# Altium schematic sheet STM32F446_Supply.SchDoc
size A4; DocumentNumber: 10; SheetNumber: 10; SheetTotal: 11
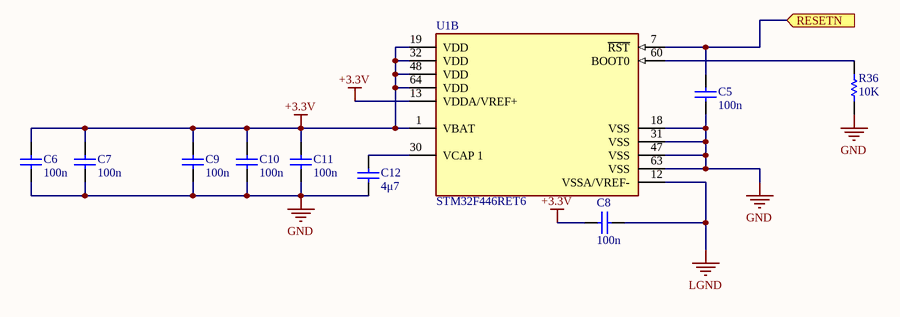
[diagram p0: STM32F446_Supply.SchDoc]

## Parts
C5  100n  [CAPC0603(1608)55_N]
C6  100n  [CAPC0603(1608)55_N]
C7  100n  [CAPC0603(1608)55_N]
C8  100n  [CAPC0603(1608)55_N]
C9  100n  [CAPC0603(1608)55_N]
C10  100n  [CAPC0603(1608)55_N]
C11  100n  [CAPC0603(1608)55_N]
C12  4μ7  [CAPC0603(1608)55_N]
R36  10K  [RESC0603(1608)_N]
U1  STM32F446RET6  [FP-LQFP64-5W-MFG]  (part B of 2)

## Ports
RESETN (in)

## Nets
+3.3V: C6.2 C7.2 C8.2 C9.2 C10.2 C11.2 U1.1(VBAT) U1.13(VDDA/VREF+) U1.19(VDD) U1.32(VDD) U1.48(VDD) U1.64(VDD)
GND: C5.1 C6.1 C7.1 C9.1 C10.1 C11.1 C12.1 R36.1 U1.18(VSS) U1.31(VSS) U1.47(VSS) U1.63(VSS)
LGND: C8.1 U1.12(VSSA/VREF-)
RESETN: C5.2 U1.7(~{RST}) ; port RESETN
NetC12_2: C12.2 U1.30(VCAP_1)
NetR36_2: R36.2 U1.60(BOOT0)

## Library data of the parts
C5-C11 = Cap 100n: Keramikvielschichtkondensator, SMD, Baureihe MC, ± 10%; Manufacturer: TDK; Voltage Rating: 50V; OC_MOUSER: CGA3E2X7R1H104K080AA; Value: 100n; PackageReference: 0603; Tolerance: ± 10%
C12 = Cap 4μ7: Keramikvielschichtkondensator, SMD, Baureihe MC, ± 10%; Manufacturer: TDK; Voltage Rating: 6.3V; OC_MOUSER: CGA3E1X5R0J475K080AC; Value: 4μ7; PackageReference: 0603; Tolerance: ± 10%
R36 = Res 10K: Chipwiderstand, SMD, Baureihe MC, 1%; Manufacturer: Multicomp; Power: 100mW; PackageReference: 0603; Value: 10K; OC_FARNELL: 9330399
U1 = CMP-12105-000007-1: IC MCU 32BIT 512KB FLASH 64LQFP; Manufacturer: ST; Number Of Spi Channels: 4; Ram Size: 128KBytes; Standoff Height: 0.05mm; Number Of Uart Channels: 6; Number Of Pwm Channels: 32; Max Junction Temp: +105°C; Number Of I/Os: 50; Number Of Usb Channels: 2; Frequency: 180MHz; Number Of A/D Converters: 3; Max Supply Voltage: 3.6V; Number Of Adc Channels: 16; Interface: I2C,SPI,UART,USART,CAN,USB,LIN,IrDA,I2S,Other; Memory Size: 512KBytes; Number Of Timers/Counters: 14; Min Supply Voltage: 1.7V; Core Architecture: ARM Cortex-M4; Data Bus Width: 32bits; Number Of Cores: 1; Ambient Temperature Range Low: -40°C; ComponentLink2URL: https://www.st.com/en/microcontrollers-microprocessors/stm32f446re.html; Category: IC; Height: 1.6mm; Ipc Land Pattern Name: QFP50P1200X1200X160-64; Manufacturer Part Number: STM32F446RET6; Octopart: https://octopart.com/stm32f446ret6-stmicroelectronics-52642920; Temperature Range High: +105°C; Lead Free: Yes; Mouser Description: ARM Microcontrollers - MCU High-performance and DSP with FP, ARM Cortex-M4 MCU with 512 Kbytes Flash, 180 MHz CPU, Art Accelerator, SDRAM; Digikey Description: IC MCU 32BIT 512KB FLASH 64LQFP; Ambient Temperature Range High: +85°C; Number Of I2C Channels: 4; Memory Type: FLASH; RoHS: TRUE; Automotive: No; Device Class L1: Integrated Circuits (ICs); Temperature: -40°C to +105°C; Device Class L2: Embedded Processors and Controllers; Device Class L3: Microcontrollers; Temperature Range Low: -40°C; Package: LQFP64-5W; ComponentLink2Description: Datasheet